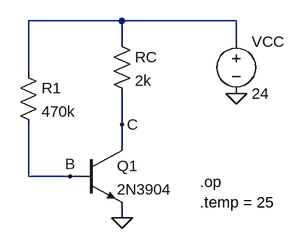
[diagram p0: schematic 007 TJB.asc]
007 TJB.asc, the LTspice schematic file:
Version 4
SHEET 1 880 680
WIRE 160 -80 16 -80
WIRE 336 -80 160 -80
WIRE 160 -48 160 -80
WIRE 336 -48 336 -80
WIRE 16 0 16 -80
WIRE 160 80 160 32
WIRE 160 112 160 80
WIRE 16 160 16 80
WIRE 80 160 16 160
WIRE 96 160 80 160
WIRE 160 224 160 208
FLAG 336 32 0
FLAG 160 80 C
FLAG 80 160 B
FLAG 160 224 0
SYMBOL npn 96 112 R0
SYMATTR InstName Q1
SYMATTR Value 2N3904
SYMBOL voltage 336 -64 R0
SYMATTR InstName VCC
SYMATTR Value 24
SYMBOL res 144 -64 R0
SYMATTR InstName RC
SYMATTR Value 2k
SYMBOL res 0 -16 R0
SYMATTR InstName R1
SYMATTR Value 470k
TEXT 280 168 Left 2 !.op
TEXT 280 200 Left 2 !.temp = 25

The netlist it stands for:
* 007 TJB.asc
Q1 C B 0 0 2N3904
VCC N001 0 24
RC N001 C 2k
R1 N001 B 470k
.model NPN NPN
.model PNP PNP
.lib standard.bjt
.op
.temp = 25
.backanno
.end